# Altium schematic sheet [01]-COVER PAGE.SchDoc
size A4; Revision: 1.0; SheetNumber: 1; SheetTotal: 2
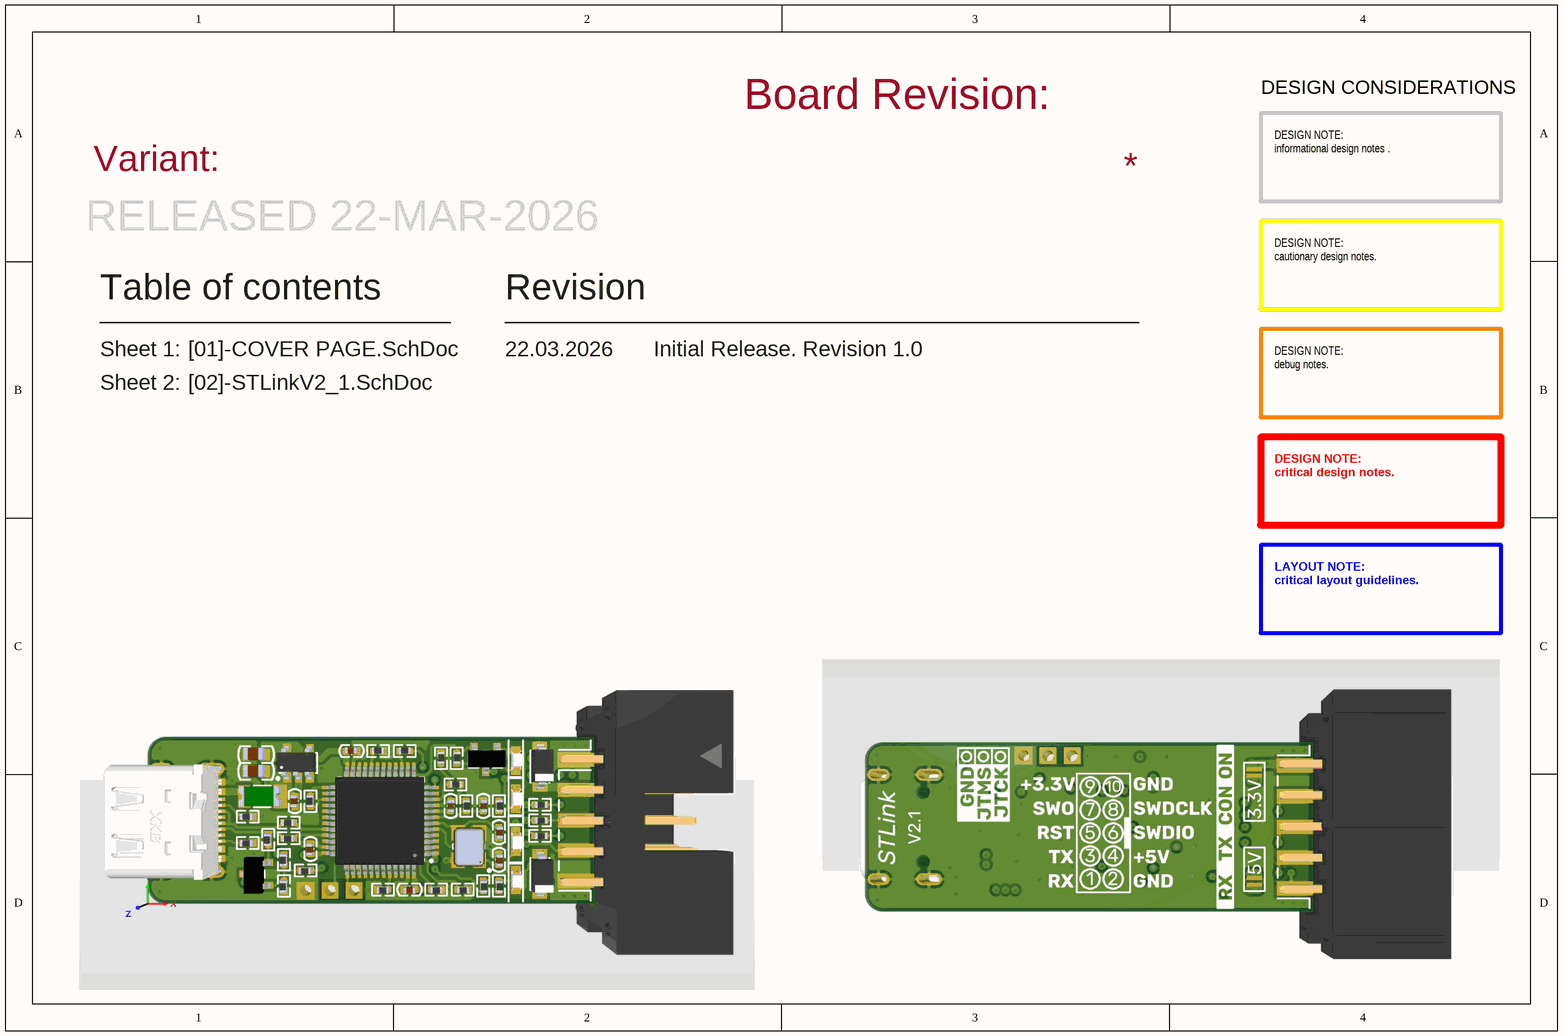
[diagram p0: [01]-COVER PAGE.SchDoc]

## Notes on the sheet
- Board Revision:
- DESIGN CONSIDERATIONS
- Variant:
- RELEASED 22-MAR-2026
- DESIGN NOTE:
  informational design notes .
- Table of contents
- Revision
- DESIGN NOTE:
  cautionary design notes.
- Sheet 1:
- 22.03.2026
- Initial Release. Revision 1.0
- Sheet 2:
- [02]-STLinkV2_1.SchDoc
- DESIGN NOTE:
  debug notes.
- DESIGN NOTE:
  critical design notes.
- LAYOUT NOTE:
  critical layout guidelines.